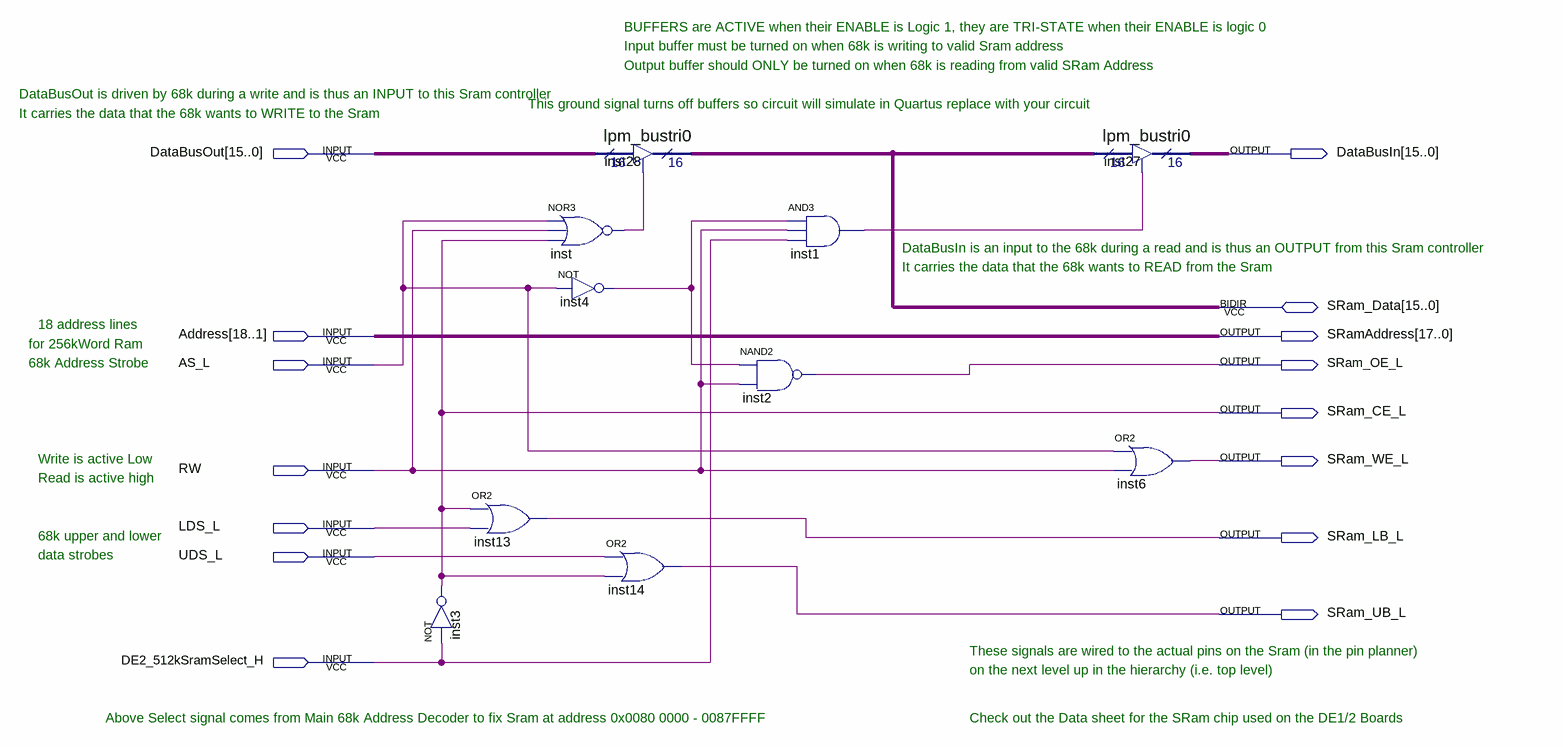
[diagram p0: schematic sheet]
// Quartus schematic StaticRamController.bdf as structural Verilog: 10 symbols, 15 pins
module StaticRamController (
  input  [15:0] DataBusOut,
  input  [18:1] Address,
  input  AS_L,
  input  RW,
  input  LDS_L,
  input  UDS_L,
  input  DE2_512kSramSelect_H,
  inout  [15:0] SRam_Data,
  output [15:0] DataBusIn,
  output [17:0] SRamAddress,
  output SRam_OE_L,
  output SRam_CE_L,
  output SRam_WE_L,
  output SRam_LB_L,
  output SRam_UB_L
);

  wire inst1_out, inst4_out, inst_out;

  not inst3 (SRam_CE_L, DE2_512kSramSelect_H);
  or inst13 (SRam_LB_L, SRam_CE_L, LDS_L);
  nor inst (inst_out, AS_L, RW, SRam_CE_L);
  not inst4 (inst4_out, AS_L);
  lpm_bustri0 inst28 (.enabledt(inst_out), .data(DataBusOut), .tridata(SRam_Data));
  or inst14 (SRam_UB_L, UDS_L, SRam_CE_L);
  nand inst2 (SRam_OE_L, inst4_out, RW);
  and inst1 (inst1_out, inst4_out, RW, DE2_512kSramSelect_H);
  lpm_bustri0 inst27 (.enabledt(inst1_out), .data(SRam_Data), .tridata(DataBusIn));
  or inst6 (SRam_WE_L, AS_L, RW);

  assign SRamAddress = Address;

  // Notes on the sheet:
  //   BUFFERS are ACTIVE when their ENABLE is Logic 1, they are TRI-STATE when their ENABLE is logic 0
  //   Input buffer must be turned on when 68k is writing to valid Sram address
  //   Output buffer should ONLY be turned on when 68k is reading from valid SRam Address
  //   DataBusOut is driven by 68k during a write and is thus an INPUT to this Sram controller
  //   This ground signal turns off buffers so circuit will simulate in Quartus replace with your circuit
  //   It carries the data that the 68k wants to WRITE to the Sram
  //   DataBusIn is an input to the 68k during a read and is thus an OUTPUT from this Sram controller
  //   It carries the data that the 68k wants to READ from the Sram
  //   18 address lines
  //   for 256kWord Ram
  //   68k Address Strobe
  //   Write is active Low
  //   Read is active high
  //   68k upper and lower
  //   data strobes
  //   These signals are wired to the actual pins on the Sram (in the pin planner)
  //   on the next level up in the hierarchy (i.e. top level)
  //   Above Select signal comes from Main 68k Address Decoder to fix Sram at address 0x0080 0000 - 0087FFFF
  //   Check out the Data sheet for the SRam chip used on the DE1/2 Boards
endmodule
